# Altium schematic sheet Reid Orthotic v2.SchDoc: CAL1020
size A4; DrawnBy: Alex Gilmour; DocumentNumber: 1; Revision: v2; SheetNumber: 1; SheetTotal: 5; PageSetup: Record=PageOptions|CenterHorizontal=True|CenterVertical=True|PrintScale=0.73|XCorrection=1.00|YCorrection=1.00|PrintKind=0|BorderSize=5000000|LeftOffset=0|BottomOffset=0|Orientation=2|PaperLength=1000|PaperWidth=1000|Scale=100|PaperSource=7|PrintQuality=-3|MediaType=1|DitherType=10|PrintScaleMode=1|PaperKind=A4|PaperIndex=9
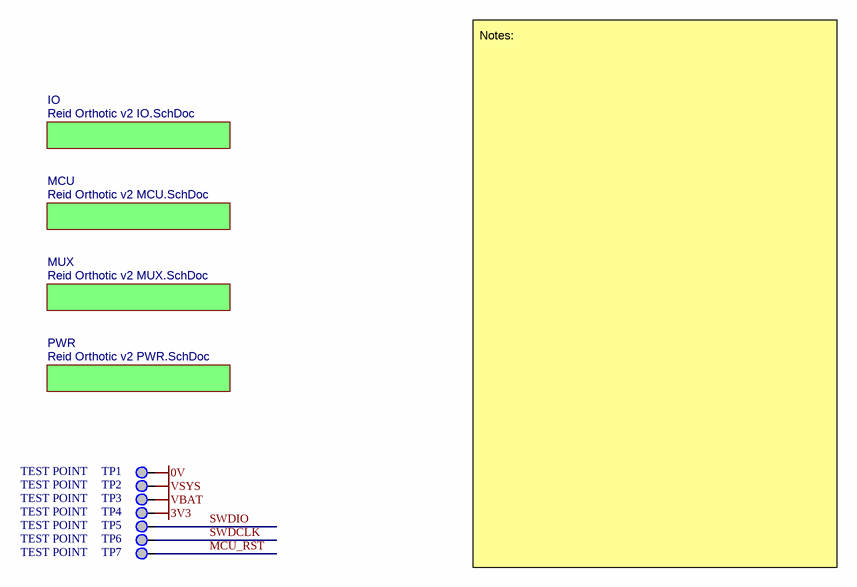
[diagram p0: Reid Orthotic v2.SchDoc]

## Parts
TP1  TEST POINT  [TEST POINT 1.0MM]  (no BOM)
TP2  TEST POINT  [TEST POINT 1.0MM]  (no BOM)
TP3  TEST POINT  [TEST POINT 1.0MM]  (no BOM)
TP4  TEST POINT  [TEST POINT 1.0MM]  (no BOM)
TP5  TEST POINT  [TEST POINT 1.0MM]  (no BOM)
TP6  TEST POINT  [TEST POINT 1.0MM]  (no BOM)
TP7  TEST POINT  [TEST POINT 1.0MM]  (no BOM)

## Sub-sheets
IO = Reid Orthotic v2 IO.SchDoc: no entries
MCU = Reid Orthotic v2 MCU.SchDoc: no entries
MUX = Reid Orthotic v2 MUX.SchDoc: no entries
PWR = Reid Orthotic v2 PWR.SchDoc: no entries

## Nets
0V: TP1.TP
3V3: TP4.TP
VBAT: TP3.TP
VSYS: TP2.TP
MCU_RST: TP7.TP
SWDCLK: TP6.TP
SWDIO: TP5.TP

## Notes on the sheet
- Notes:
- A.B.N. 89 367 394 425
- Revision
- Drawn by
- Last updated
- Sheet
- of